# EAGLE design servodriver (EAGLE 6.5.0)
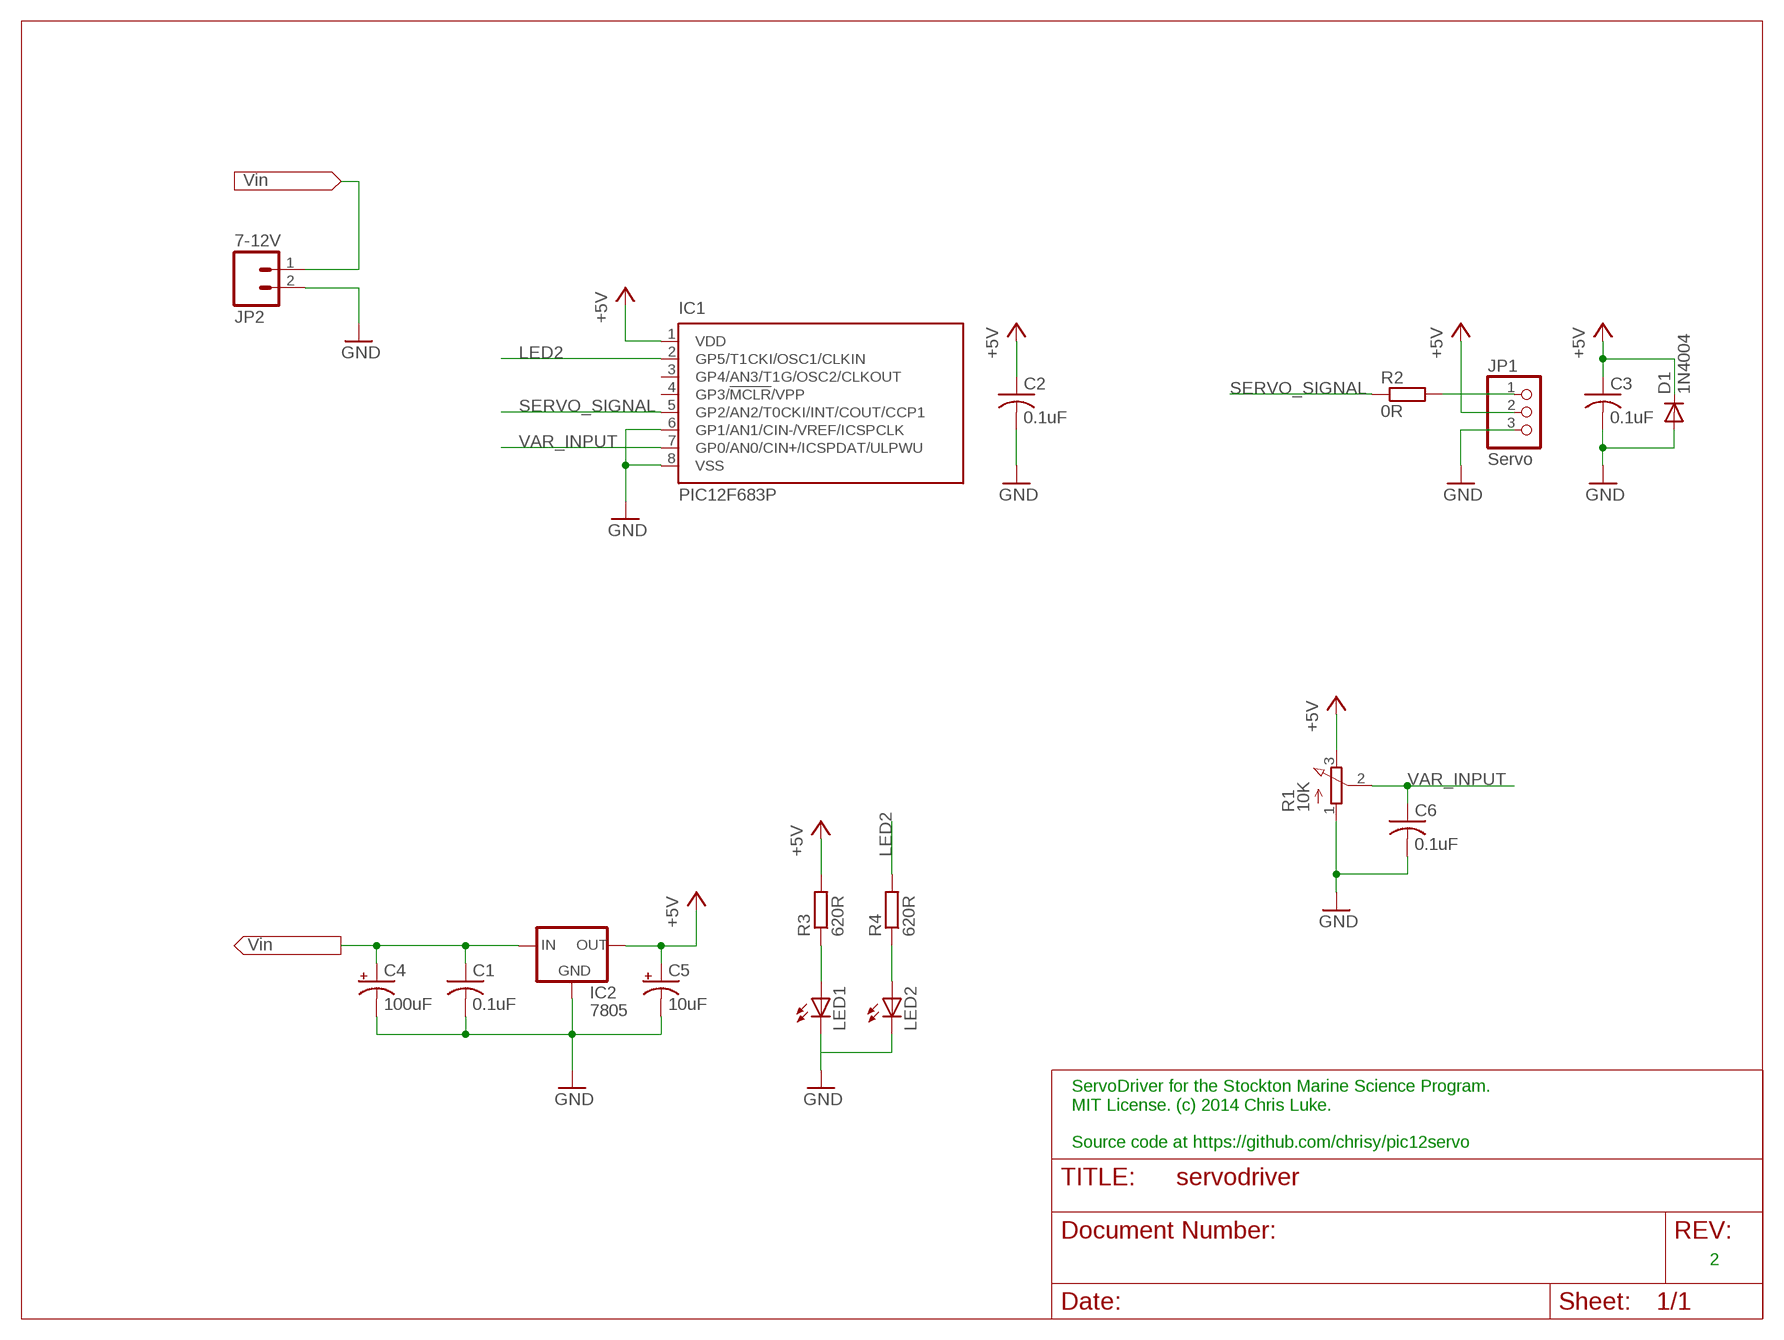
[diagram p0: schematic, sheet 1]

## Parts
C1  0.1uF  C-US025-025X050  [C025-025X050]
C2  0.1uF  C-US025-025X050  [C025-025X050]
C3  0.1uF  C-US025-025X050  [C025-025X050]
C4  100uF  CPOL-USE2.5-6  [E2,5-6]
C5  10uF  CPOL-USE2.5-6  [E2,5-6]
C6  0.1uF  C-US025-025X050  [C025-025X050]
D1  1N4004  [DO41-10]
IC1  PIC12F683P  [DIL8]
IC2  7805  78XXL  [78XXL]
JP1  Servo  PINHD-1X3  [1X03]
JP2  7-12V  M023.5MM  [SCREWTERMINAL-3.5MM-2]
LED1  LED3MM  [LED3MM]
LED2  LED3MM  [LED3MM]
R1  10K  3RP/1610N  [3RP/1610N]
R2  0R  R-EU_0207/10  [0207/10]
R3  620R  R-EU_0207/10  [0207/10]
R4  620R  R-EU_0207/10  [0207/10]

## Nets
+5V [power]: C2.1 C3.1 C5.+ D1.C IC1.1(VDD) IC2.OUT JP1.2 R1.3(E) R3.2
GND [power]: C1.2 C2.2 C3.2 C4.- C5.- C6.2 D1.A IC1.6(GP1/AN1/CIN-/VREF/ICSPCLK) IC1.8(VSS) IC2.GND JP1.3 JP2.2 LED1.K(C) LED2.K(C) R1.1(A)
LED2: IC1.2(GP5/T1CKI/OSC1/CLKIN) R4.2
N$1: JP1.1 R2.2
N$2: LED1.A R3.1
N$3: LED2.A R4.1
SERVO_SIGNAL: IC1.5(GP2/AN2/T0CKI/INT/COUT/CCP1) R2.1
VAR_INPUT: C6.1 IC1.7(GP0/AN0/CIN+/ICSPDAT/ULPWU) R1.2(S)
VIN [power]: C1.1 C4.+ IC2.IN JP2.1
Unconnected: IC1.3(GP4/AN3/T1G/OSC2/CLKOUT) IC1.4(GP3/!MCLR!/VPP)

## Notes on the sheet
- ServoDriver for the Stockton Marine Science Program.
  MIT License. (c) 2014 Chris Luke.
  
  Source code at https://github.com/chrisy/pic12servo
- 2

## Library data of the parts
C1-C3 C6 = rcl:C-US: CAPACITOR, American symbol
C4 C5 = rcl:CPOL-US: POLARIZED CAPACITOR, American symbol
D1 = diode:1N4004: DIODE general purpose rectifier, 1 A
IC1 = microchip:PIC12F683: 8-Pin Flash-Based, 8-Bit CMOS Microcontrollers with nanoWatt Technology Source: http://ww1.microchip.com/downloads/en/DeviceDoc/41211D_.pdf; MF: MICROCHIP; MPN: PIC12F683-I/P; OC_FARNELL: 9759034; OC_NEWARK: 89H0442
IC2 = v-reg:78XXL: VOLTAGE REGULATOR
JP1 = pinhead:PINHD-1X3: PIN HEADER
JP2 = SparkFun-Connectors:M02: Standard 2-pin 0.1" header. Use with - straight break away headers ( PRT-00116) - right angle break away headers (PRT-00553) - swiss pins (PRT-00743) - machine pins (PRT-00117) - female headers (PRT-00115) Molex polarized connector foot print use with: PRT-08233 with associated crimp pins and housings. 2.54_SCREWTERM for use with PRT-10571. 3.5mm Screw Terminal footprints for PRT-08084 5mm Screw Terminal footprints for use with PRT-08433
LED1 LED2 = led:LED: LED OSRAM: - CHIPLED LG R971, LG N971, LY N971, LG Q971, LY Q971, LO R971, LY R971 LH N974, LH R974 LS Q976, LO Q976, LY Q976 LO Q996 - Hyper CHIPLED LW Q18S LB Q993, LB Q99A, LB R99A - SideLED LS A670, LO A670, LY A670, LG A670, LP A670 LB A673, LV A673, LT A673, LW A673 LH A674 LY A675 LS A676, LA A676, LO A676, LY A676, LW A676 LS A679, LY A679, LG A679 - Hyper Micro SIDELED® LS Y876, LA Y876, LO Y876, LY Y876 LT Y87S - SmartLED LW L88C, LW L88S LB L89C, LB L89S, LG L890 LS L89K, LO L89K, LY L89K LS L896, LA L896, LO L896, LY L896 - TOPLED LS T670, LO T670, LY T670, LG T670, LP T670 LSG T670, LSP T670, LSY T670, LOP T670, LYG T670 LG T671, LOG T671, LSG T671 LB T673, LV T673, LT T673, LW T673 LH T674 LS T676, LA T676, LO T676, LY T676, LB T676, LH T676, LSB T676, LW T676 LB T67C, LV T67C, LT T67C, LS T67K, LO T67K, LY T67K, LW E67C LS E67B, LA E67B, LO E67B, LY E67B, LB E67C, LV E67C, LT E67C LW T67C LS T679, LY T679, LG T679 LS T770, LO T770, LY T770, LG T770, LP T770 LB T773, LV T773, LT T773, LW T773 LH T774 LS E675, LA E675, LY E675, LS T675 LS T776, LA T776, LO T776, LY T776, LB T776 LHGB T686 LT T68C, LB T68C - Hyper Mini TOPLED® LB M676 - Mini TOPLED Santana® LG M470 LS M47K, LO M47K, LY M47K Source: http://www.osram.convergy.de LUXEON: - LUMILED® LXK2-PW12-R00, LXK2-PW12-S00, LXK2-PW14-U00, LXK2-PW14-V00 LXK2-PM12-R00, LXK2-PM12-S00, LXK2-PM14-U00 LXK2-PE12-Q00, LXK2-PE12-R00, LXK2-PE12-S00, LXK2-PE14-T00, LXK2-PE14-U00 LXK2-PB12-K00, LXK2-PB12-L00, LXK2-PB12-M00, LXK2-PB14-N00, LXK2-PB14-P00, LXK2-PB14-Q00 LXK2-PR12-L00, LXK2-PR12-M00, LXK2-PR14-Q00, LXK2-PR14-R00 LXK2-PD12-Q00, LXK2-PD12-R00, LXK2-PD12-S00 LXK2-PH12-R00, LXK2-PH12-S00 LXK2-PL12-P00, LXK2-PL12-Q00, LXK2-PL12-R00 Source: www.luxeon.com KINGBRIGHT: KA-3528ASYC Source: www.kingbright.com
R1 = pot:3RP/1610N: 16mm Potentiometer one level Source: http://www.alphapotentiometers.net/html/16mm_pot_2.html
R2-R4 = rcl:R-EU_: RESISTOR, European symbol

## Net classes
0 default: width 1.27 mm, drill 0.762 mm, clearance 0.762 mm
1 power: width 1.27 mm, drill 0.762 mm, clearance 0.762 mm to class 0, clearance 0.762 mm

## Board
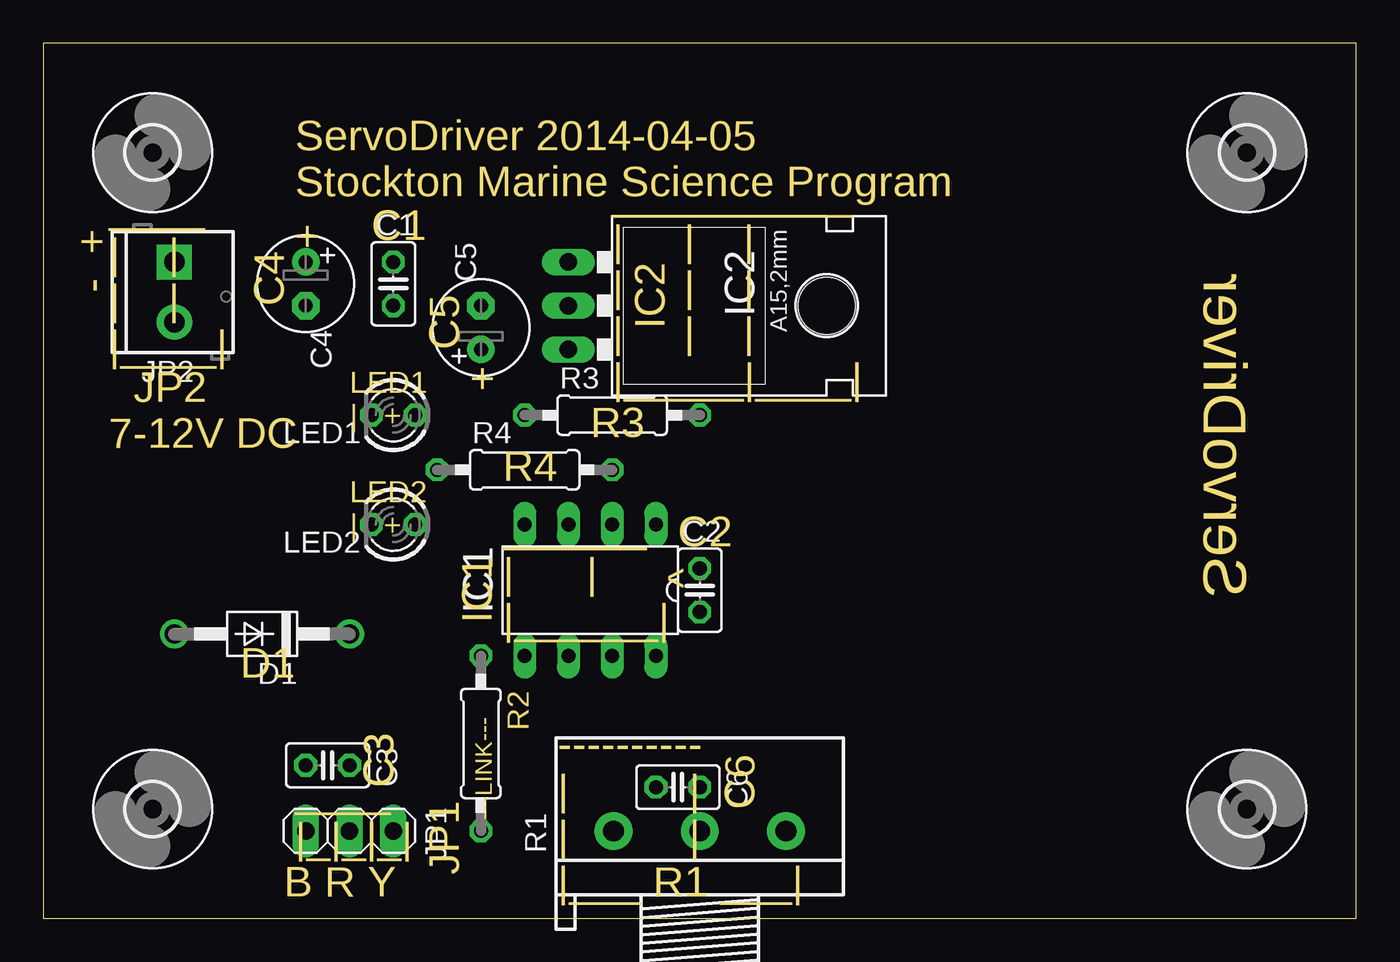
[diagram p1: board, top side]
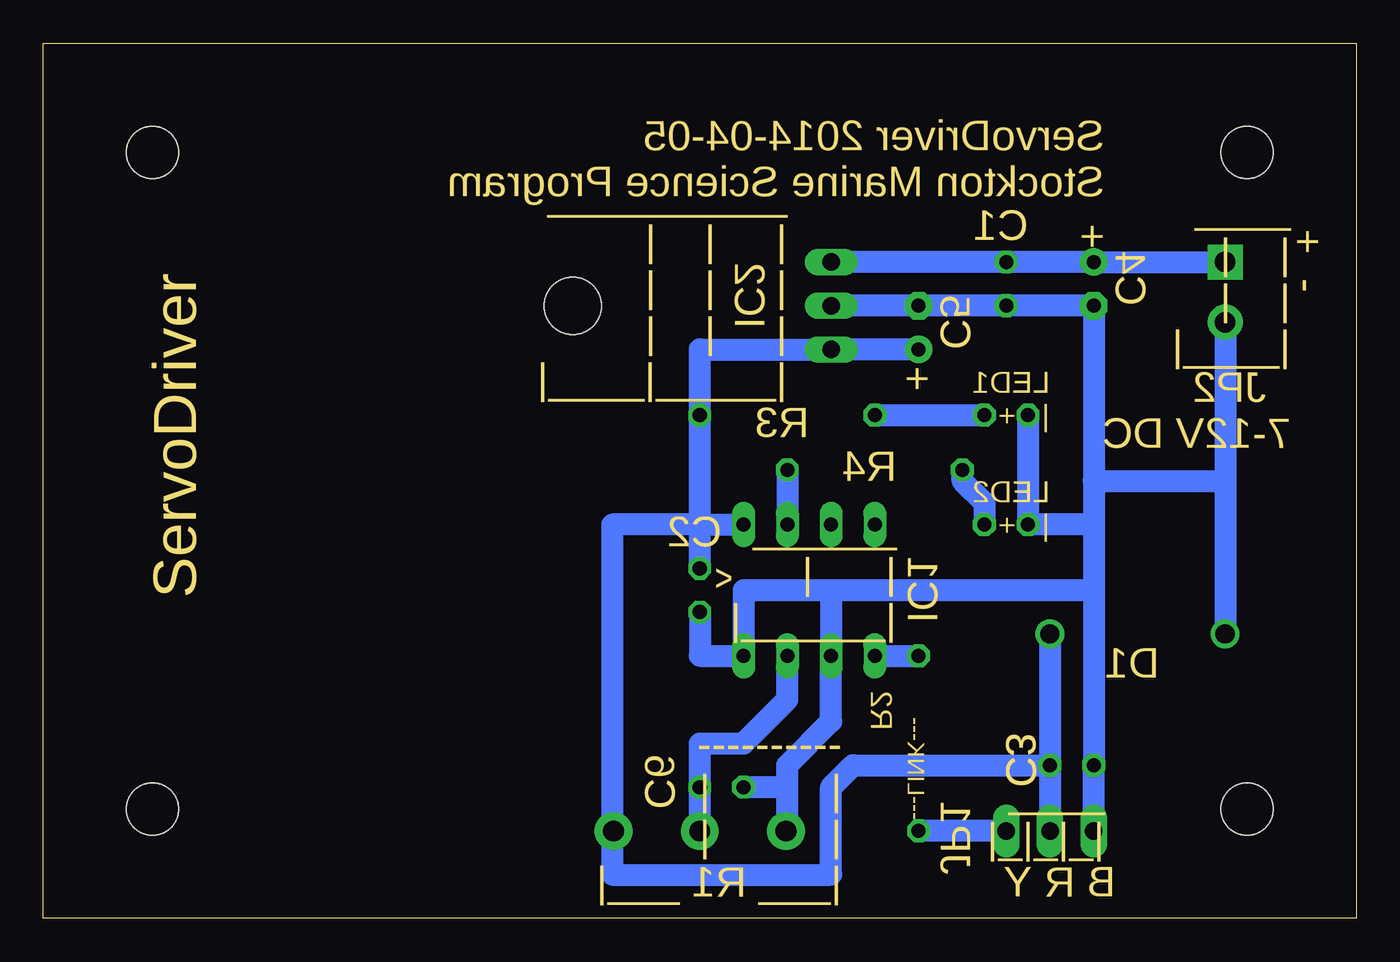
[diagram p2: board, bottom side, seen from below]

Size 76.2 x 50.8 mm. Coordinates in mm from the lower left corner, seen from the top.
Outline: 0,0 76.2,0 76.2,50.8 0,50.8 0,0
Copper layers (1*16): Top 0.035mm / dielectric 1.5mm / Bottom 0.035mm
Design rules "default *": minimum track width 10mil, minimum drill 24mil, track to track 25mil, track to pad 25mil, pad to pad 25mil, via to via 25mil, smd to smd 25mil, copper to edge 40mil, drill to drill 8mil, minimum pad ring 10mil, minimum via ring 8mil, stop-mask expansion 4mil, vias tented up to drill 0mil, thermal gap 10mil

### Footprints (pad centres in the part's own frame; a part is rotated, then mirrored left to right if it is on the bottom)
C025-025X050 = drill 0.813 octagon: 1 -1.27,0; 2 1.27,0
E2,5-6 = drill 0.813 pad 1.6: + -1.27,0 | drill 0.813 pad 1.6 octagon: - 1.27,0
DO41-10 = drill 1.118: A 5.08,0; C -5.08,0
DIL8 = drill 0.813 long: 1 -3.81,-3.81; 2 -1.27,-3.81; 3 1.27,-3.81; 4 3.81,-3.81; 5 3.81,3.81; 6 1.27,3.81; 7 -1.27,3.81; 8 -3.81,3.81
78XXL = drill 1.016 long: GND 0,-3.81; IN -2.54,-3.81; OUT 2.54,-3.81 | hole 3.302: 0,11.176
1X03 = drill 1.016 long: 1 -2.54,0; 2 0,0; 3 2.54,0
SCREWTERMINAL-3.5MM-2 = drill 1.2 pad 2.032 square: 1 0,0 | drill 1.2 pad 2.032: 2 3.5,0
LED3MM = drill 0.813 octagon: A -1.27,0; K 1.27,0
3RP/1610N = drill 1.2 pad 2.184: 1 -5,0; 2 0,0; 3 5,0
0207/10 = drill 0.813 octagon: 1 -5.08,0; 2 5.08,0
3,0 = hole 3: 0,0

### Placement (x,y rotation side)
C1  20.32,36.83 270 top
C2  38.1,19.05 270 top
C3  16.51,8.89 180 top
C4  15.24,36.83 270 top
C5  25.4,34.29 90 top
C6  36.83,7.62 180 top
D1  12.7,16.51 180 top
IC1  31.75,19.05 180 top
IC2  34.29,35.56 270 top
JP1  17.78,5.08 180 top
JP2  7.62,38.1 270 top
LED1  20.32,29.21 180 top
LED2  20.32,22.86 180 top
R1  38.1,5.08 0 top
R2  25.4,10.16 270 top
R3  33.02,29.21 0 top
R4  27.94,26.04 0 top
U$1  [3,0]  6.35,44.45 0 top
U$2  [3,0]  6.35,6.35 0 top
U$3  [3,0]  69.85,6.35 0 top
U$4  [3,0]  69.85,44.45 0 top

### Tracks (layer width: path | path; a pad name or v marks a point on that pad's centre or on a via)
+5V
  Bottom 1.27: D1.C C3.1 | C3.1 JP1.2 | C5.+ IC2.OUT 38.1,33.02 R3.2 38.1,22.86 | 38.1,22.86 IC1.1 | C2.1 38.1,22.86 | 43.18,5.08 43.18,22.86 38.1,22.86 | C3.1 29.21,8.89 30.48,7.62 30.48,2.54 43.18,2.54 43.18,5.08 | 43.18,5.08 R1.3
GND
  Bottom 1.27: JP2.2 7.62,25.4 | 7.62,25.4 D1.A | 33.02,7.62 C6.2 | 33.02,7.62 33.02,5.08 R1.1 | 33.02,7.62 33.02,8.89 30.48,11.43 IC1.6 30.48,19.05 | IC2.GND C5.- C1.2 C4.- 15.24,25.4 | LED1.K LED2.K 15.24,22.86 | C2.2 38.1,15.24 IC1.8 35.56,19.05 30.48,19.05 | JP1.3 C3.2 15.24,19.05 | 15.24,25.4 15.24,22.86 | 15.24,22.86 15.24,19.05 | 15.24,19.05 30.48,19.05 | 15.24,25.4 7.62,25.4
LED2
  Bottom 1.27: R4.2 IC1.2
N$1
  Bottom 1.27: JP1.1 R2.2
N$2
  Bottom 1.27: R3.1 LED1.A
N$3
  Bottom 1.27: LED2.A 21.59,24.13 22.86,25.4 R4.1
SERVO_SIGNAL
  Bottom 1.27: IC1.5 R2.1
VAR_INPUT
  Bottom 1.27: R1.2 C6.1 38.1,10.16 35.56,10.16 33.02,12.7 IC1.7
VIN
  Bottom 1.27: IC2.IN C1.1 C4.+ JP2.1

### Text on the board
tNames: IC2
Milling: ServoDriver 2014-04-05 / Stockton Marine Science Program | - + | + | C1 | ServoDriver | C4 | C5 | ____ / | | / | | / |____| | JP2 | + | __________ / | | | / | | | / | | | / |_____|____| | LED1 / | + | R3 | 7-12V DC | R4 | LED2 / | + | C2 | ^ | IC1 | ______ / | | / |______| | D1 | C3 | C3 | ---LINK--- | C6 | ____ / |_|_|_| | JP1 | B R Y | ---------- / | | / | | / |___ R1 ___|